# EAGLE design Atari SIO2SD Igi version (EAGLE 8.0.1)
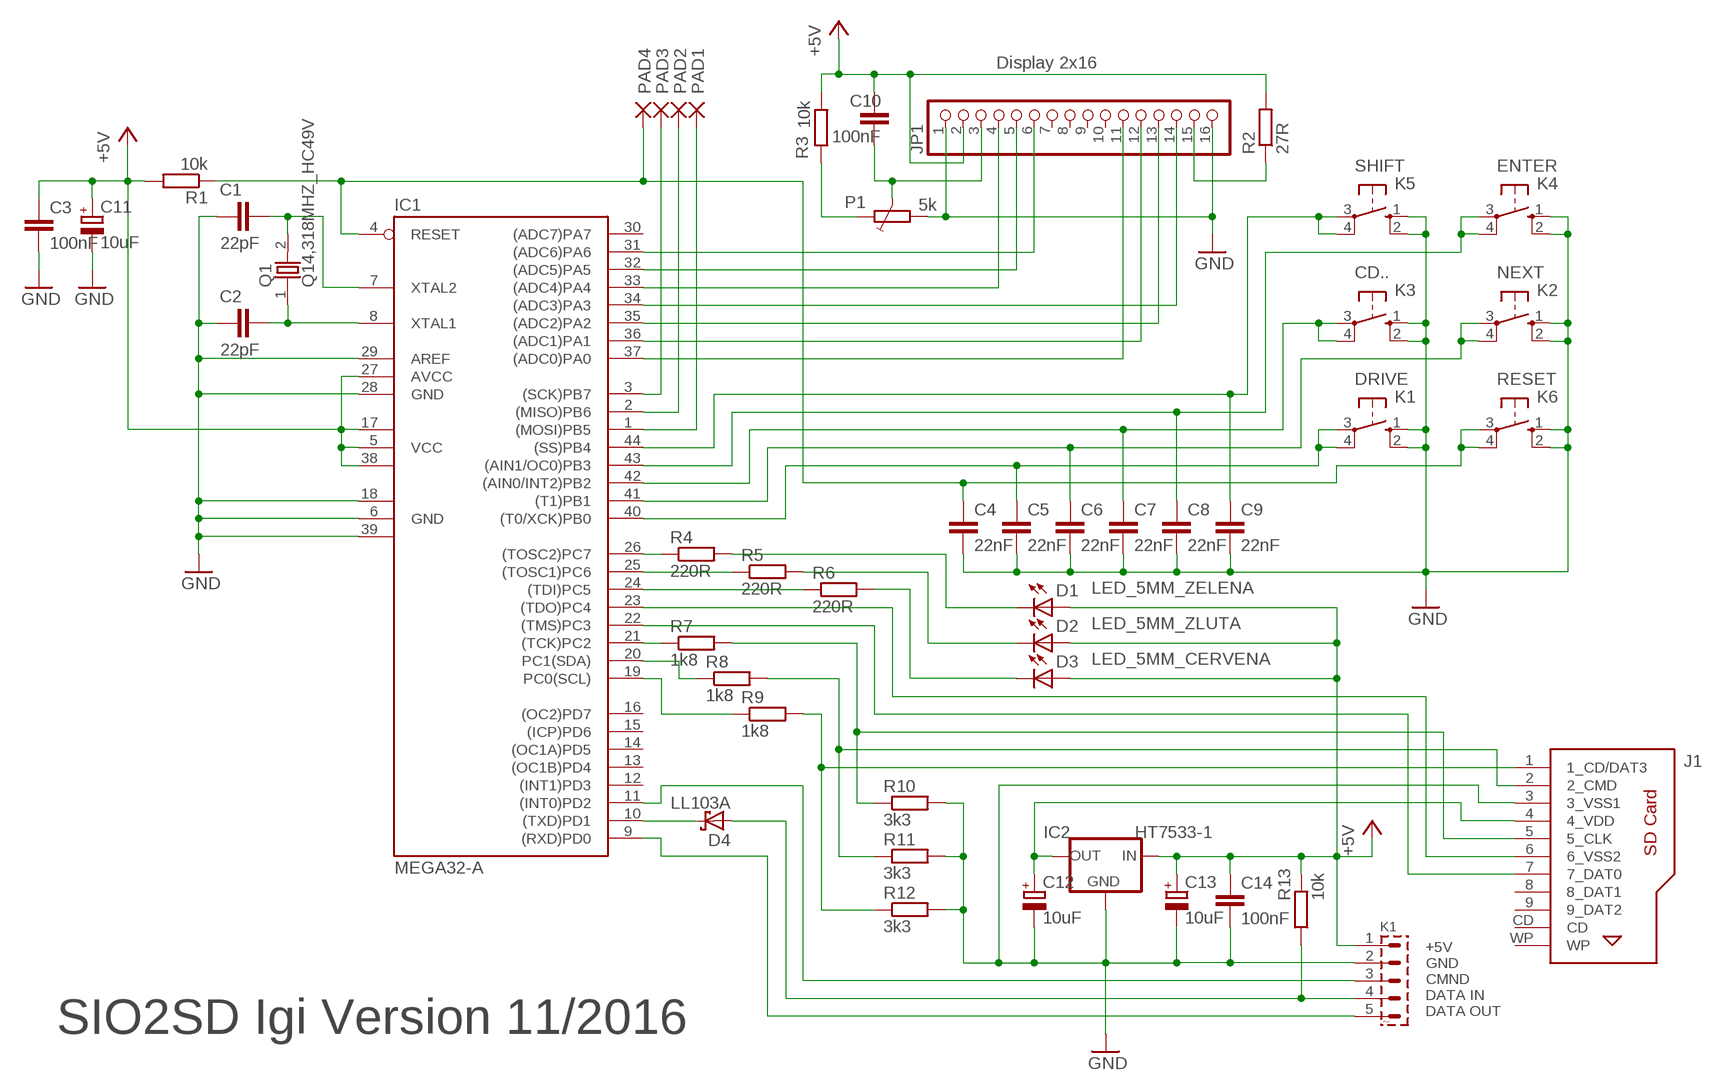
[diagram p0: schematic, sheet 1]

## Parts
C1  22pF  C-SMD1206  [1206]
C2  22pF  C-SMD1206  [1206]
C3  100nF  C-SMD1206  [1206]
C4  22nF  C-SMD1206  [1206]
C5  22nF  C-SMD1206  [1206]
C6  22nF  C-SMD1206  [1206]
C7  22nF  C-SMD1206  [1206]
C8  22nF  C-SMD1206  [1206]
C9  22nF  C-SMD1206  [1206]
C10  100nF  C-SMD1206  [1206]
C11  10uF  CTSA  [A/3216]
C12  10uF  CTSA  [A/3216]
C13  10uF  CTSA  [A/3216]
C14  100nF  C-SMD1206  [1206]
CD..  K3  10-XX  [B3F-10XX]
D1  LED_5MM_ZELENA  [A5,0]
D2  LED_5MM_ZLUTA  [A5,0]
D3  LED_5MM_CERVENA  [A5,0]
D4  LL103A  [MINIMELF]
DRIVE  K1  10-XX  [B3F-10XX]
ENTER  K4  10-XX  [B3F-10XX]
IC1  MEGA32-A  [TQFP44]
IC2  HT7533-1  HT7533-1_SMD  [SOT89R]
J1  693061010911  [693061010911]
JP1  Display 2x16  PINHD-1X16  [1X16]
K1  PSH02-05W  [PSH02-05W]
NEXT  K2  10-XX  [B3F-10XX]
P1  5k  3362P  [3362P]
PAD1  SMD2  [SMD1,27-2,54]
PAD2  SMD2  [SMD1,27-2,54]
PAD3  SMD2  [SMD1,27-2,54]
PAD4  SMD2  [SMD1,27-2,54]
Q1  Q14,318MHZ_HC49V  [HC49U-V]
R1  10k  R1206  [R1206]
R2  27R  R1206  [R1206]
R3  10k  R1206  [R1206]
R4  220R  R1206  [R1206]
R5  220R  R1206  [R1206]
R6  220R  R1206  [R1206]
R7  1k8  R1206  [R1206]
R8  1k8  R1206  [R1206]
R9  1k8  R1206  [R1206]
R10  3k3  R1206  [R1206]
R11  3k3  R1206  [R1206]
R12  3k3  R1206  [R1206]
R13  10k  R1206  [R1206]
RESET  K6  10-XX  [B3F-10XX]
SHIFT  K5  10-XX  [B3F-10XX]

## Nets
+5V: C3.1 C10.1 C11.+ C13.+ C14.1 D1.A D2.A D3.A IC1.5(VCC) IC1.17(VCC1) IC1.27(AVCC) IC1.38(VCC2) IC2.2(IN) IC2.4(IN) JP1.2 K1.1 R1.2 R2.2 R3.1 R13.2
GND [GND]: C1.1 C2.1 C3.2 C4.2 C5.2 C6.2 C7.2 C8.2 C9.2 C11.- C12.- C13.- C14.2 CD...1(S) CD...2(S1) DRIVE.1(S) DRIVE.2(S1) ENTER.1(S) ENTER.2(S1) IC1.6(GND) IC1.18(GND1) IC1.28(GND) IC1.29(AREF) IC1.39(GND2) IC2.1(GND) J1.3(3_VSS1) JP1.1 JP1.16 K1.2 NEXT.1(S) NEXT.2(S1) P1.A R10.2 R11.2 R12.2 RESET.1(S) RESET.2(S1) SHIFT.1(S) SHIFT.2(S1)
N$1: C1.2 IC1.7(XTAL2) Q1.2
N$2: C2.2 IC1.8(XTAL1) Q1.1
N$3: C10.2 JP1.3 P1.S
N$4: IC1.26((TOSC2)PC7) R4.1
N$5: P1.E R3.2
N$6: C7.1 CD...3(P) CD...4(P1) IC1.42((AIN0/INT2)PB2)
N$7: IC1.31((ADC6)PA6) JP1.6
N$8: JP1.15 R2.1
N$9: IC1.32((ADC5)PA5) JP1.5
N$10: IC1.33((ADC4)PA4) JP1.4
N$11: IC1.34((ADC3)PA3) JP1.14
N$12: IC1.35((ADC2)PA2) JP1.13
N$13: IC1.36((ADC1)PA1) JP1.12
N$14: IC1.37((ADC0)PA0) JP1.11
N$15: C9.1 IC1.44((SS)PB4) SHIFT.3(P) SHIFT.4(P1)
N$16: C8.1 ENTER.3(P) ENTER.4(P1) IC1.43((AIN1/OC0)PB3)
N$17: IC1.25((TOSC1)PC6) R5.1
N$18: C6.1 IC1.41((T1)PB1) NEXT.3(P) NEXT.4(P1)
N$19: C5.1 DRIVE.3(P) DRIVE.4(P1) IC1.40((T0/XCK)PB0)
N$20: C4.1 IC1.4(RESET) PAD4.1(P) R1.1 RESET.3(P) RESET.4(P1)
N$21: IC1.24((TDI)PC5) R6.1
N$22: D1.K(C) R4.2
N$23: D2.K(C) R5.2
N$24: D3.K(C) R6.2
N$25: IC1.1((MOSI)PB5) PAD1.1(P)
N$26: IC1.23((TDO)PC4) J1.6(6_VSS2)
N$27: IC1.22((TMS)PC3) J1.7(7_DAT0)
N$28: IC1.21((TCK)PC2) R7.1
N$29: IC1.20(PC1(SDA)) R8.1
N$30: IC1.19(PC0(SCL)) R9.1
N$31: J1.5(5_CLK) R7.2 R10.1
N$32: J1.2(2_CMD) R8.2 R11.1
N$33: J1.1(1_CD/DAT3) R9.2 R12.1
N$34: C12.+ IC2.3(OUT) J1.4(4_VDD)
N$35: D4.C IC1.10((TXD)PD1)
N$36: D4.A K1.4 R13.1
N$37: IC1.11((INT0)PD2) K1.3
N$38: IC1.9((RXD)PD0) K1.5
N$39: IC1.2((MISO)PB6) PAD2.1(P)
N$40: IC1.3((SCK)PB7) PAD3.1(P)
Unconnected: IC1.12((INT1)PD3) IC1.13((OC1B)PD4) IC1.14((OC1A)PD5) IC1.15((ICP)PD6) IC1.16((OC2)PD7) IC1.30((ADC7)PA7) J1.8(8_DAT1) J1.9(9_DAT2) J1.CD J1.WP JP1.7 JP1.8 JP1.9 JP1.10

## Notes on the sheet
- +5V
  GND
  CMND
  DATA IN
  DATA OUT
- SIO2SD Igi Version 11/2016

## Library data of the parts
C1-C10 C14 = keramicke kondenzatory SMD:C-SMD: Kondenzátory keramické SMD 50 V
C11-C13 = kondenzatory tantalove:CTS: Kondenzátory tantalové - SMD
CD.. DRIVE ENTER NEXT RESET SHIFT = switch-omron:10-XX: OMRON SWITCH; MPN: B3F-1000; OC_FARNELL: 176432; OC_NEWARK: 36M3542
D1 = LED diody:LED_5MM_ZELENA: LED 5mm
D2 = LED diody:LED_5MM_ZLUTA: LED 5mm
D3 = LED diody:LED_5MM_CERVENA: LED 5mm
D4 = diody SMD:LL103A: Schottky
IC1 = atmel:MEGA32: MICROCONTROLLER 32 Kbytes FLASH 2 Kbytes SRAM 1 Kbytes EEPROM USART 8-channel 10 bit ADC Source: www.atmel.com .. doc2503.pdf; MPN: ATMEGA32-16AU; OC_FARNELL: 9171274; OC_NEWARK: 69K6677
IC2 = stabilizatory:HT7533-1_SMD: VOLTAGE REGULATOR
J1 = sd-mmc:693061010911: WR-CRD SD CARD CONNECTOR PUSH & PUSH WITH CARD DETECTION 9 PINS=>Code : Con_I-O_COM_CRD_SD_Normal_693061010911 <http://katalog.we-online.de/media/images/eican/Con_I-O_COM_CRD_SD_Normal_693061010911_pf2.jpg> Details see: http://katalog.we-online.de/en/em/693_061_010_911 Created 2014-07-09, Karrer Zheng 2014 (C) Würth Elektronik
JP1 = pinhead:PINHD-1X16: PIN HEADER
K1 = #PaJa_konektory:PSH02-05: Konektory se zamkem - vidlice - 5pin
P1 = odporove trimry:3362P: Odporové trimry 3362P
PAD1-PAD4 = wirepad:SMD2: SMD PAD
Q1 = krystaly:Q14,318MHZ_HC49: Krystal s pouzdrem HC-49U
R1-R13 = rezistory SMD:R1206: Rezistor SMD 1206

## Net classes
0 default: width 0.254 mm, drill 0.61 mm, clearance 0.254 mm
1 GND: width 0.61 mm, drill 0.61 mm, clearance 0.61 mm

## Board
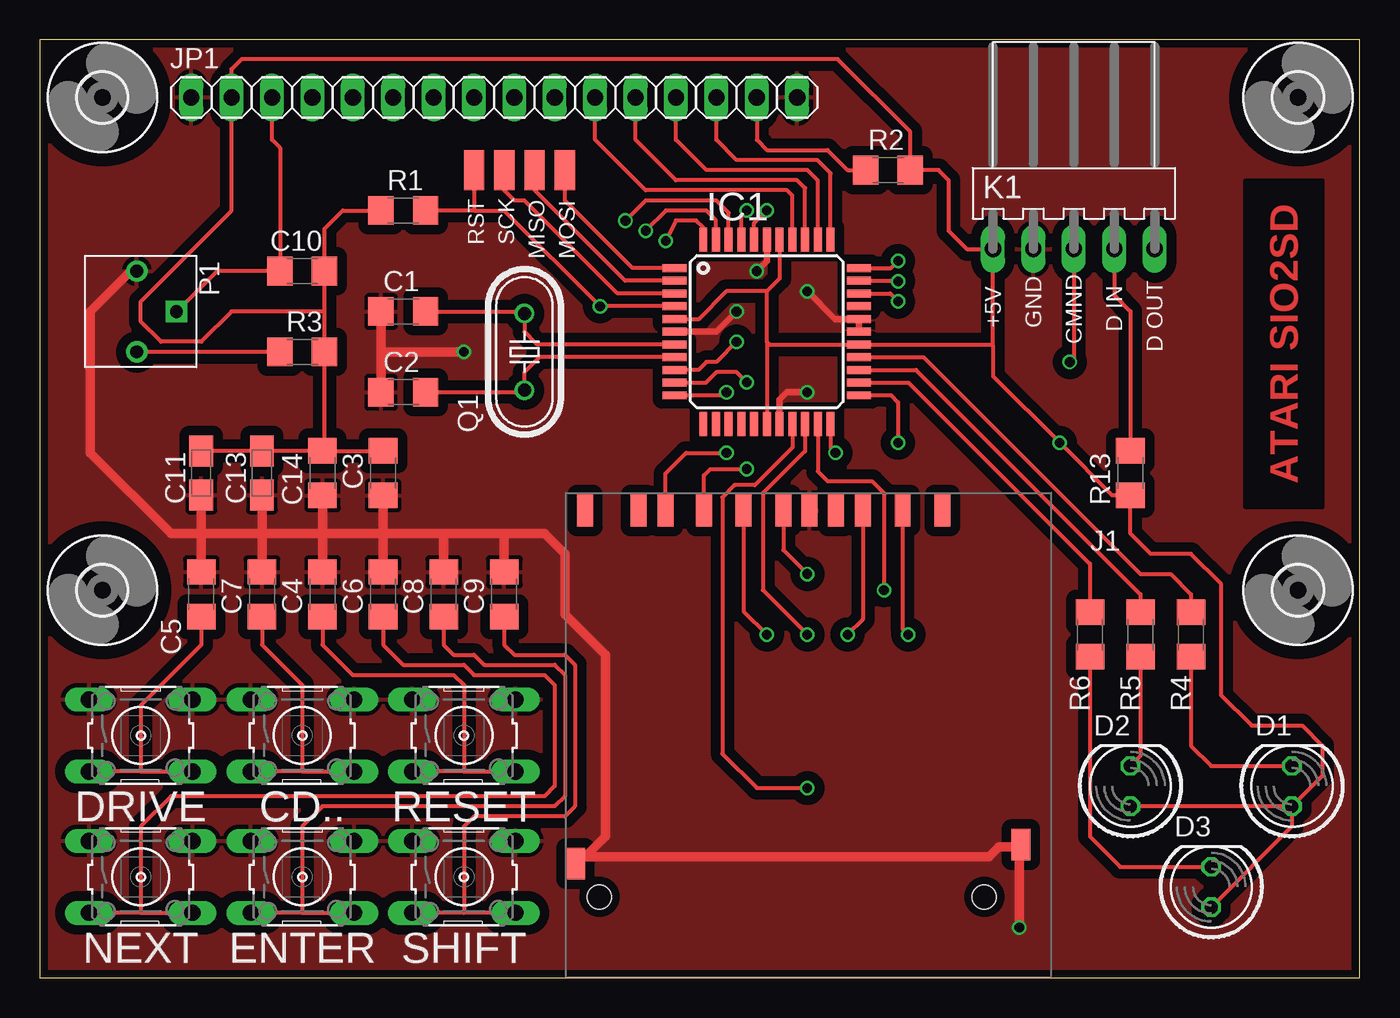
[diagram p1: board, top side]
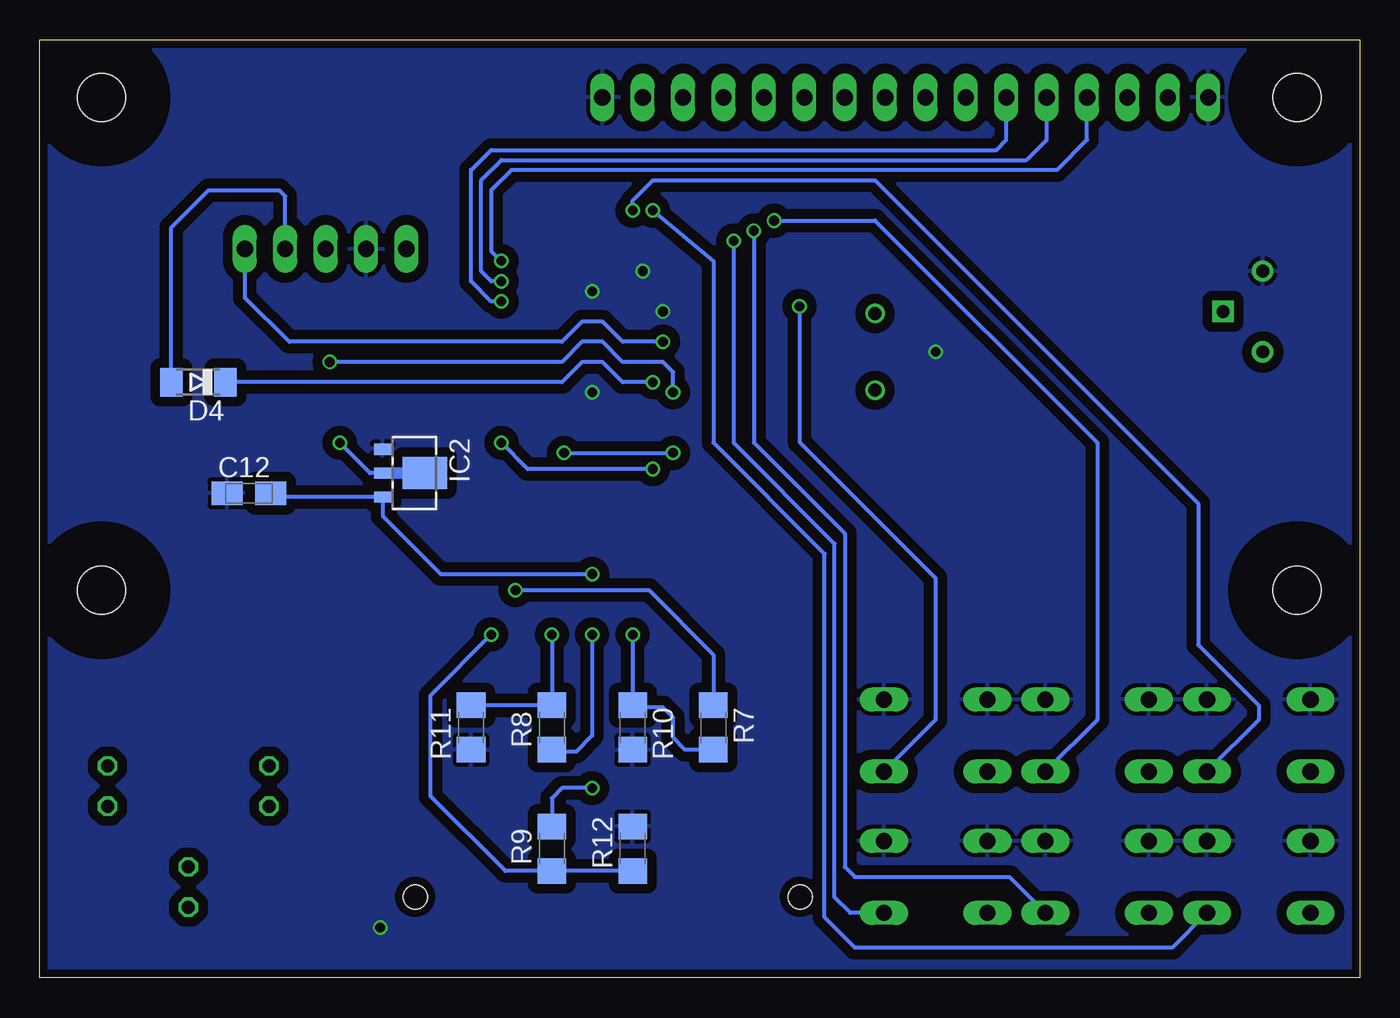
[diagram p2: board, bottom side, seen from below]

Size 83 x 59 mm. Coordinates in mm from the lower left corner, seen from the top.
Outline: 0,0 83,0 83,59 0,59 0,0
Copper layers (1*16): Top 0.035mm / dielectric 1.6mm / Bottom 0.035mm
Design rules "Elecrow_2-layer_PCB_eagle_rule": minimum track width 6mil, minimum drill 12mil, track to track 6mil, track to pad 6mil, pad to pad 6mil, via to via 8mil, smd to smd 0mil, copper to edge 20mil, drill to drill 10mil, minimum pad ring 6mil, minimum via ring 6mil, stop-mask expansion 0mil, vias tented up to drill 100mil, thermal gap 10mil

### Footprints (pad centres in the part's own frame; a part is rotated, then mirrored left to right if it is on the bottom)
1206 = smd 1.6 x 1.8: 1 -1.4,0; 2 1.4,0
A/3216 = smd 1.95 x 1.5: + 1.375,0; - -1.375,0
B3F-10XX = drill 1.016 long: 1 -3.251,2.261; 2 3.251,2.261; 3 -3.251,-2.261; 4 3.251,-2.261
A5,0 = drill 0.813 octagon: A -1.27,0; K 1.27,0
MINIMELF = smd 1.4 x 1.8: A 1.7,0; C -1.7,0
TQFP44 = smd 1.5 x 0.5: 1 -5.8,4; 2 -5.8,3.2; 3 -5.8,2.4; 4 -5.8,1.6; 5 -5.8,0.8; 6 -5.8,0; 7 -5.8,-0.8; 8 -5.8,-1.6; 9 -5.8,-2.4; 10 -5.8,-3.2; 11 -5.8,-4; 23 5.8,-4; 24 5.8,-3.2; 25 5.8,-2.4; 26 5.8,-1.6; 27 5.8,-0.8; 28 5.8,0; 29 5.8,0.8; 30 5.8,1.6; 31 5.8,2.4; 32 5.8,3.2; 33 5.8,4 | smd 0.5 x 1.5: 12 -4,-5.8; 13 -3.2,-5.8; 14 -2.4,-5.8; 15 -1.6,-5.8; 16 -0.8,-5.8; 17 0,-5.8; 18 0.8,-5.8; 19 1.6,-5.8; 20 2.4,-5.8; 21 3.2,-5.8; 22 4,-5.8; 34 4,5.8; 35 3.2,5.8; 36 2.4,5.8; 37 1.6,5.8; 38 0.8,5.8; 39 0,5.8; 40 -0.8,5.8; 41 -1.6,5.8; 42 -2.4,5.8; 43 -3.2,5.8; 44 -4,5.8
SOT89R = smd 0.7 x 1.1: 1 -1.5,-1.75; 2 0,-1.75; 3 1.5,-1.75 | smd 2 x 2.8: 4 0,0.9
693061010911 = smd 1 x 2: 1 19.97,0; 2 17.47,0; 3 14.12,0; 4 12.47,0; 5 9.97,0; 6 7.47,0; 7 5.05,0; 8 3.35,0; 9 22.47,0; CD 15.77,0; WP 0,0 | smd 1.2 x 2: P$12 -0.6,-22.21; P$13 27.4,-21.01 | hole 1.5: 0.9,-24.31; 25.1,-24.31
1X16 = drill 1.016 long: 1 -19.05,0; 2 -16.51,0; 3 -13.97,0; 4 -11.43,0; 5 -8.89,0; 6 -6.35,0; 7 -3.81,0; 8 -1.27,0; 9 1.27,0; 10 3.81,0; 11 6.35,0; 12 8.89,0; 13 11.43,0; 14 13.97,0; 15 16.51,0; 16 19.05,0
PSH02-05W = drill 1.016 pad 1.422 long: 1 -5.08,0; 2 -2.54,0; 3 0,0; 4 2.54,0; 5 5.08,0
3362P = drill 0.8 pad 1.35: A -2.54,-0.25; E 2.54,-0.25 | drill 0.8 pad 1.35 square: S 0,2.25
SMD1,27-2,54 = smd 1.27 x 2.54: 1 0,0
HC49U-V = drill 0.813: 1 -2.413,0; 2 2.413,0
R1206 = smd 1.6 x 1.8: 1 -1.4,0; 2 1.4,0
3,0 = hole 3: 0,0

### Placement (x,y rotation side)
C1  22.86,41.91 0 top
C2  22.86,36.83 0 top
C3  21.59,31.75 270 top
C4  17.78,24.13 90 top
C5  10.16,24.13 90 top
C6  21.59,24.13 90 top
C7  13.97,24.13 90 top
C8  25.4,24.13 90 top
C9  29.21,24.13 90 top
C10  16.51,44.45 180 top
C11  10.16,31.75 90 top
C12  69.85,30.48 0 bottom
C13  13.97,31.75 90 top
C14  17.78,31.75 270 top
CD..  16.51,15.24 0 top
D1  78.74,12.06 90 top
D2  68.58,12.06 90 top
D3  73.66,5.71 90 top
D4  73.03,37.47 180 bottom
DRIVE  6.35,15.24 0 top
ENTER  16.51,6.35 0 top
IC1  45.72,40.64 0 top
IC2  59.69,31.75 270 bottom
J1  34.29,29.4 0 top
JP1  28.57,55.37 0 top
K1  65.02,45.85 0 top
NEXT  6.35,6.35 0 top
P1  6.35,41.91 270 top
PAD1  33.02,50.8 180 top
PAD2  31.11,50.8 180 top
PAD3  29.21,50.8 180 top
PAD4  27.3,50.8 0 top
Q1  30.48,39.37 90 top
R1  22.86,48.26 180 top
R2  53.34,50.8 0 top
R3  16.51,39.37 180 top
R4  72.39,21.59 270 top
R5  69.22,21.59 270 top
R6  66.04,21.59 270 top
R7  40.64,15.75 270 bottom
R8  50.8,15.75 90 bottom
R9  50.8,8.13 270 bottom
R10  45.72,15.75 270 bottom
R11  55.88,15.75 270 bottom
R12  45.72,8.13 90 bottom
R13  68.58,31.75 270 top
RESET  26.67,15.24 0 top
SHIFT  26.67,6.35 0 top
U$1  [3,0]  3.94,55.37 0 top
U$2  [3,0]  3.94,24.38 0 top
U$3  [3,0]  79.12,24.38 0 top
U$4  [3,0]  79.12,55.37 0 top

### Tracks (layer width: path | path; a pad name or v marks a point on that pad's centre or on a via)
+5V  (via drill 0.61)
  Top 0.254: C14.1 C3.1 | C14.1 17.8,33.15 C13.+ C11.+ | R1.2 19.05,48.26 17.91,47.12 C10.1 17.91,41.91 | C14.1 17.91,33.28 R3.1 17.91,41.91 | IC1.5 41.44,41.44 43.18,43.18 45.72,43.18 | 45.72,40.01 IC1.17 | 45.72,40.01 45.72,43.18 | 45.72,40.01 45.88,39.84 IC1.27 59.85,39.84 59.94,39.75 | IC1.38 46.52,43.98 45.72,43.18 | 59.94,39.75 K1.1 58.29,45.85 57.15,46.99 57.15,50.16 56.52,50.8 R2.2 54.74,53.21 50.16,57.78 12.7,57.78 12.06,57.15 JP1.2 12.06,48.26 6.35,42.55 6.35,41.27 7.62,40.01 10.16,40.01 12.06,41.91 17.91,41.91 | 59.94,39.75 59.94,37.85 v64.14,33.66 67.44,30.35 R13.2 68.58,27.94 69.85,26.67 72.39,26.67 74.3,24.77 74.3,17.78 76.2,15.88 79.38,15.88 80.64,14.61 80.64,12.7 D1.A | D1.A D2.A | D1.A 78.74,9.53 D3.A
  Bottom 0.254: v64.14,33.66 62.23,31.75 IC2.2 IC2.4
GND  (via drill 0.61)
  Top 0.406: IC1.28 IC1.29 50,41.44 v48.26,43.18 | IC1.39 45.72,45.09 v45.09,44.45 | IC1.18 46.52,36.36 46.99,36.83 v48.26,36.83 | IC1.6 42.55,40.64 v43.81,41.91
  Top 0.61: 13.97,27.94 17.78,27.94 | 13.97,27.94 10.16,27.94 | 21.59,27.94 17.78,27.94 | 25.4,27.94 21.59,27.94 | 25.4,27.94 29.21,27.94 | C5.2 10.16,27.94 | C4.2 17.78,27.94 | C6.2 21.59,27.94 | C8.2 25.4,27.94 | C9.2 29.21,27.94 | 10.16,27.94 8.26,27.94 3.17,33.02 3.17,41.91 5.71,44.45 P1.A | C11.- 10.16,27.94 | C2.1 21.46,39.37 | 21.46,39.37 C1.1 | 29.21,27.94 31.75,27.94 33.02,26.67 33.02,22.86 35.56,20.32 35.56,8.89 34.29,7.62 59.69,7.62 60.33,8.26 61.59,8.26 v61.59,3.17 | C13.- 13.97,27.94 | C14.2 17.78,27.94 | C3.2 21.59,27.94 | C7.2 13.97,27.94 | 21.46,39.37 v26.67,39.37
  pour Bottom (isolate 0.254): 0,59 83,59 83,0 0,0
  pour Top (isolate 0.254): 0,0 83,0 83,59 0,59
N$1
  Top 0.254: IC1.7 31.28,39.84 30.48,40.64 Q1.2 30.35,41.91 C1.2
N$2
  Top 0.254: IC1.8 31.42,39.04 30.48,38.1 Q1.1 30.35,36.83 C2.2
N$3
  Top 0.254: JP1.3 14.61,52.7 15.11,52.2 C10.2 11.14,44.45 P1.S
N$4
  Top 0.254: IC1.26 55.58,39.04 69.22,25.4 71.12,25.4 72.39,24.13 R4.1
N$5
  Top 0.254: R3.2 P1.E
N$6  (via drill 0.61)
  Top 0.254: 16.51,12.98 CD...4 | 16.51,12.98 CD...3 | C7.1 13.97,20.95 16.51,18.41 16.51,12.98 | IC1.42 43.32,48.12 42.55,48.9 38.1,48.9 v36.83,47.62
  Bottom 0.254: v36.83,47.62 30.48,47.62 16.51,33.66 16.51,16.23 CD...4
N$7  (via drill 0.61)
  Top 0.254: IC1.31 53.48,43.04 v53.98,42.55
  Bottom 0.254: v53.98,42.55 54.61,42.55 55.88,43.81 55.88,50.8 54.61,52.07 22.86,52.07 22.23,52.7 JP1.6
N$8
  Top 0.254: JP1.15 45.09,52.7 45.72,52.07 49.53,52.07 50.8,50.8 R2.1
N$9  (via drill 0.61)
  Top 0.254: IC1.32 53.95,43.84 v53.98,43.81
  Bottom 0.254: v53.98,43.81 54.61,43.81 55.24,44.45 55.24,50.16 53.98,51.44 20.95,51.44 19.68,52.7 JP1.5
N$10  (via drill 0.61)
  Top 0.254: IC1.33 53.53,44.64 v53.98,45.09
  Bottom 0.254: JP1.4 17.14,52.7 19.05,50.8 53.34,50.8 54.61,49.53 54.61,45.72 v53.98,45.09
N$11
  Top 0.254: IC1.34 49.72,50.61 48.9,51.44 43.81,51.44 42.55,52.7 JP1.14
N$12
  Top 0.254: IC1.35 48.92,50.14 48.26,50.8 41.91,50.8 40.01,52.7 JP1.13
N$13
  Top 0.254: IC1.36 48.12,49.67 47.62,50.16 40.01,50.16 37.47,52.7 JP1.12
N$14
  Top 0.254: IC1.37 47.32,49.2 46.99,49.53 38.1,49.53 34.92,52.7 JP1.11
N$15  (via drill 0.61)
  Top 0.254: 26.67,4.09 SHIFT.3 | SHIFT.4 26.67,4.09 | 26.67,4.09 26.67,9.53 27.3,10.16 33.02,10.16 33.66,10.79 33.66,19.68 33.02,20.32 29.84,20.32 29.21,20.95 C9.1 | IC1.44 41.72,47.18 41.27,47.62 40.01,47.62 v39.37,46.35
  Bottom 0.254: v39.37,46.35 39.37,33.66 33.02,27.3 33.02,5.08 32.03,4.09 SHIFT.4
N$16  (via drill 0.61)
  Top 0.254: 16.51,4.09 ENTER.3 | 16.51,4.09 ENTER.4 | C8.1 25.4,20.95 26.04,20.32 27.3,20.32 27.94,19.68 32.38,19.68 33.02,19.05 33.02,11.43 32.38,10.79 17.78,10.79 16.51,9.53 16.51,4.09 | IC1.43 42.52,47.65 41.91,48.26 39.37,48.26 v38.1,46.99
  Bottom 0.254: v38.1,46.99 38.1,33.66 32.38,27.94 32.38,6.99 31.75,6.35 22.02,6.35 ENTER.4
N$17
  Top 0.254: IC1.25 55.1,38.24 69.22,24.13 R5.1
N$18  (via drill 0.61)
  Top 0.254: 6.35,4.09 NEXT.3 | 6.35,4.09 NEXT.4 | 6.35,4.09 6.35,9.53 8.26,11.43 31.75,11.43 32.38,12.06 32.38,18.41 31.75,19.05 27.3,19.05 26.67,19.68 22.86,19.68 21.59,20.95 C6.1 | IC1.41 44.12,47.95 v44.45,48.26
  Bottom 0.254: v44.45,48.26 40.64,45.09 40.64,33.66 33.66,26.67 33.66,3.81 31.75,1.91 11.79,1.91 NEXT.4
N$19  (via drill 0.61)
  Top 0.254: 6.35,12.98 DRIVE.4 | 6.35,12.98 DRIVE.3 | C5.1 10.16,20.95 6.35,17.14 6.35,12.98 | IC1.40 44.92,47.46 v45.72,48.26
  Bottom 0.254: v45.72,48.26 45.72,48.9 44.45,50.16 30.48,50.16 10.16,29.84 10.16,20.95 6.35,17.14 6.35,16.23 DRIVE.4
N$20  (via drill 0.61)
  Top 0.254: 26.67,12.98 RESET.3 | 26.67,12.98 RESET.4 | C4.1 17.78,20.95 19.68,19.05 26.04,19.05 26.67,18.41 26.67,12.98 | IC1.4 v35.23,42.24 29.21,48.26 27.3,48.26 | 27.3,48.26 R1.1 | PAD4.1 27.3,48.26
  Bottom 0.254: RESET.4 26.67,16.23 26.67,25.15 35.23,33.71 v35.23,42.24
N$21
  Top 0.254: 51.55,37.47 IC1.24 54.63,37.44 66.04,26.04 R6.1
N$22
  Top 0.254: R4.2 72.39,14.61 73.66,13.34 D1.K
N$23
  Top 0.254: R5.2 69.22,13.97 D2.K
N$24
  Top 0.254: R6.2 66.04,8.89 67.94,6.99 D3.K
N$25
  Top 0.254: IC1.1 37.27,44.64 33.02,48.9 PAD1.1
N$26  (via drill 0.61)
  Top 0.254: IC1.23 53.53,36.64 53.98,36.2 v53.98,33.66 | J1.6 41.76,31.6 42.16,32 v44.45,32
  Bottom 0.254: v44.45,32 52.32,32 v53.98,33.66
N$27  (via drill 0.61)
  Top 0.254: J1.7 39.34,31.72 40.64,33.02 v43.18,33.02 | 49.78,34.78 IC1.22 49.72,33.34 v50.04,33.02
  Bottom 0.254: v50.04,33.02 v43.18,33.02
N$28  (via drill 0.61)
  Top 0.254: IC1.21 48.92,31.85 49.53,31.24 52.32,31.24 53.09,30.48 v53.09,24.38
  Bottom 0.254: v53.09,24.38 44.7,24.38 40.64,20.32 R7.1
N$29  (via drill 0.61)
  Top 0.254: IC1.20 48.12,33.13 45.47,30.48 45.47,24.38 v48.26,21.59
  Bottom 0.254: v48.26,21.59 48.26,15.24 49.28,14.22 50.68,14.22 R8.1
N$30  (via drill 0.61)
  Top 0.254: v48.26,11.94 45.09,11.94 42.93,14.1 42.93,30.23 43.69,30.99 44.96,30.99 47.32,33.35 IC1.19
  Bottom 0.254: v48.26,11.94 50.16,11.94 50.8,11.3 R9.1
N$31  (via drill 0.61)
  Top 0.254: J1.5 44.26,23.05 v45.72,21.59
  Bottom 0.254: R7.2 42.41,14.35 43.18,15.11 43.18,16.38 43.81,17.02 45.59,17.02 R10.1 v45.72,21.59
N$32  (via drill 0.61)
  Top 0.254: J1.2 51.76,22.55 v50.8,21.59
  Bottom 0.254: R11.1 R8.2 v50.8,21.59
N$33  (via drill 0.61)
  Top 0.254: J1.1 54.26,21.94 v54.61,21.59
  Bottom 0.254: R12.1 R9.2 53.72,6.73 58.42,11.43 58.42,17.78 v54.61,21.59
N$34  (via drill 0.61)
  Top 0.254: J1.4 46.76,26.9 v48.26,25.4
  Bottom 0.254: C12.+ 68.47,30.25 IC2.3 61.44,29.05 57.78,25.4 v48.26,25.4
N$35  (via drill 0.61)
  Top 0.254: IC1.10 41.88,37.44 42.55,38.1 43.81,38.1 v44.45,37.47
  Bottom 0.254: v44.45,37.47 46.35,37.47 47.62,38.73 48.9,38.73 50.16,37.47 D4.C
N$36
  Top 0.254: R13.1 68.58,41.91 67.56,42.93 K1.4
  Bottom 0.254: K1.4 67.56,49.15 67.94,49.53 72.39,49.53 74.72,47.2 D4.A
N$37  (via drill 0.61)
  Top 0.254: IC1.11 42.99,36.64 v43.18,36.83 | K1.3 65.02,38.99 v64.77,38.73
  Bottom 0.254: v43.18,36.83 43.18,38.1 43.81,38.73 46.35,38.73 47.62,40.01 48.9,40.01 50.16,38.73 v64.77,38.73
N$38  (via drill 0.61)
  Top 0.254: IC1.9 41.41,38.24 41.91,38.73 42.55,38.73 v43.81,40.01
  Bottom 0.254: K1.5 70.1,42.8 67.31,40.01 50.16,40.01 48.9,41.27 47.62,41.27 46.35,40.01 v43.81,40.01
N$39
  Top 0.254: IC1.2 36.8,43.84 31.11,49.53 PAD2.1
N$40
  Top 0.254: IC1.3 36.34,43.04 30.48,48.9 29.84,48.9 29.21,49.53 PAD3.1
N$41
  cutout Top: 75.82,50.16 80.64,50.16 80.64,29.59 75.82,29.59

### Text on the board
Top: ATARI SIO2SD
tNames: RST | SCK | MISO | MOSI | +5V | GND | D IN | CMND | D OUT